# Altium schematic sheet Digital Interfaces.SchDoc
size A4
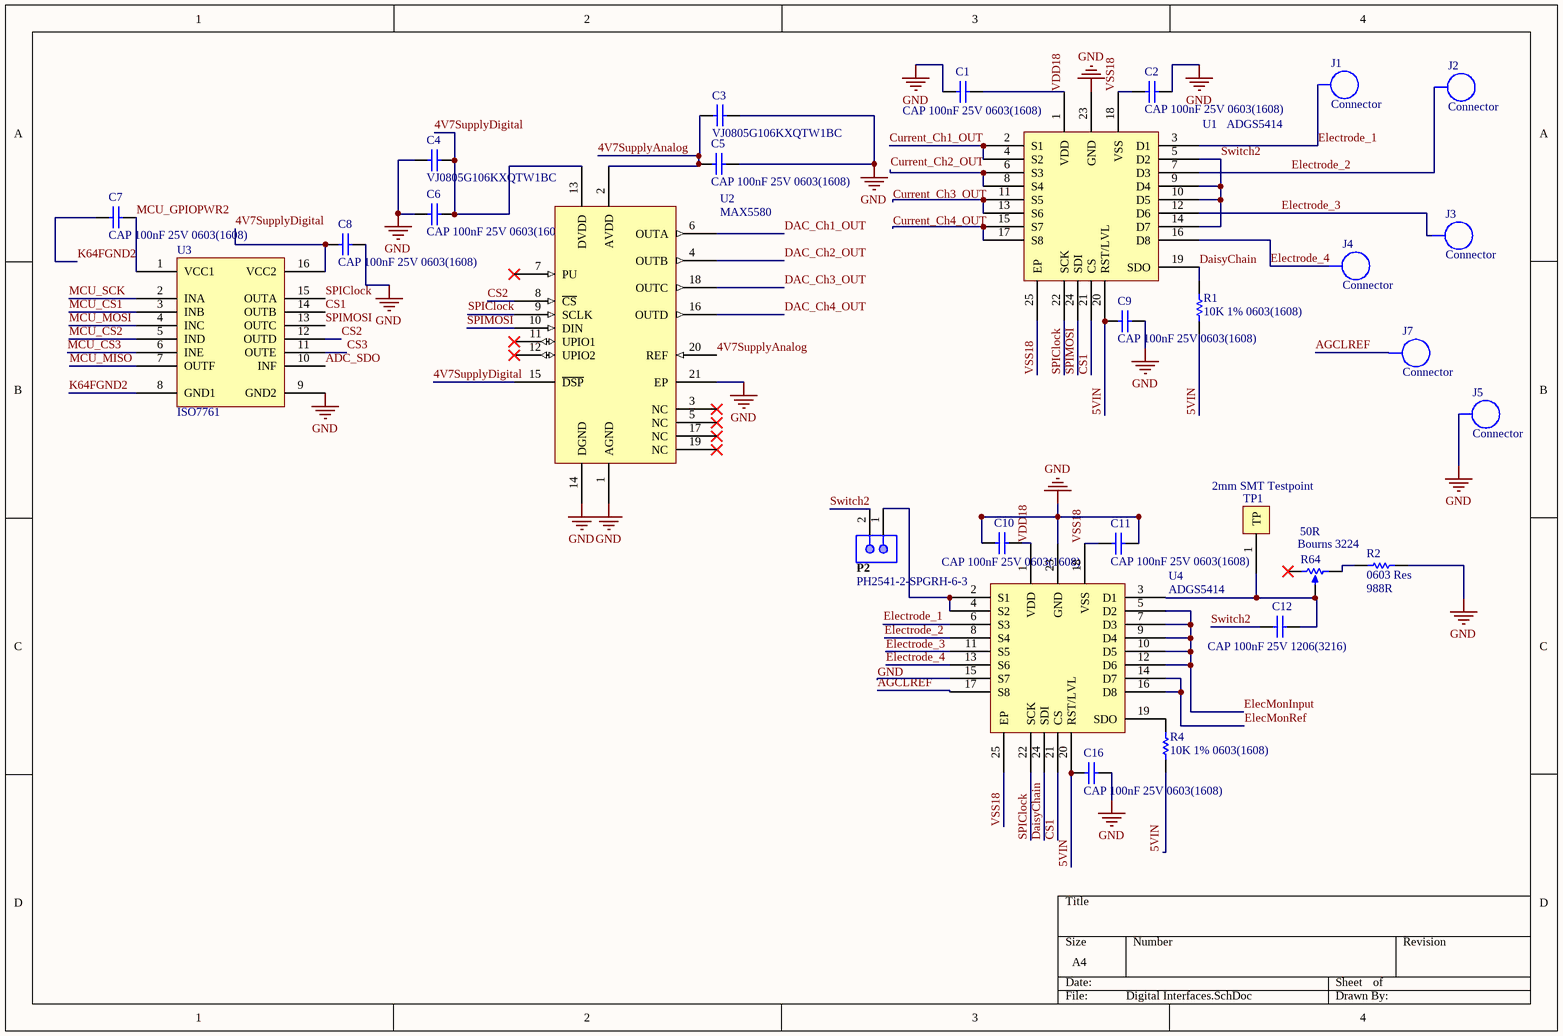
[diagram p0: Digital Interfaces.SchDoc]

## Parts
C1  CAP 100nF 25V 0603(1608)  [CAPC0603(1608)100_N]
C2  CAP 100nF 25V 0603(1608)  [CAPC0603(1608)100_N]
C3  VJ0805G106KXQTW1BC  [CAPC2013X145X50LL20T20]
C4  VJ0805G106KXQTW1BC  [CAPC2013X145X50LL20T20]
C5  CAP 100nF 25V 0603(1608)  [CAPC0603(1608)100_N]
C6  CAP 100nF 25V 0603(1608)  [CAPC0603(1608)100_N]
C7  CAP 100nF 25V 0603(1608)  [CAPC0603(1608)100_N]
C8  CAP 100nF 25V 0603(1608)  [CAPC0603(1608)100_N]
C9  CAP 100nF 25V 0603(1608)  [CAPC0603(1608)100_N]
C10  CAP 100nF 25V 0603(1608)  [CAPC0603(1608)100_N]
C11  CAP 100nF 25V 0603(1608)  [CAPC0603(1608)100_N]
C12  CAP 100nF 25V 1206(3216)  [CAPC1206(3216)190_M]
C16  CAP 100nF 25V 0603(1608)  [CAPC0603(1608)100_N]
J1  Connector  [Molex TermiMate Plug]
J2  Connector  [Molex TermiMate Plug]
J3  Connector  [Molex TermiMate Plug]
J4  Connector  [Molex TermiMate Plug]
J5  Connector  [Molex TermiMate Plug]
J7  Connector  [Molex TermiMate Plug]
P2  PH2541-2-SPGRH-6-3  [PH2541-2-SPGRH-6-3_V]
R1  10K 1% 0603(1608)  [RESC0603(1608)_N]
R2  0603 Res  value 988R  [J1-0603]
R4  10K 1% 0603(1608)  [RESC0603(1608)_N]
R64  Bourns 3224  value 50R  [BOURNS 3224W]
TP1  2mm SMT Testpoint  [Testpoint Harwin S1751]
U1  ADGS5414  [24LFCSP JEDEC MO-220-VGGD-8]
U2  MAX5580  [20TSSOP-EP U20E-1]
U3  ISO7761  [16SSOP JEDEC MO-137 AB]
U4  ADGS5414  [24LFCSP JEDEC MO-220-VGGD-8]

## Nets
GND: C1.1 C2.1 C3.2 C4.1 C5.1 C6.2 C8.1 C9.1 C10.1 C11.1 C16.1 J5.1 R2.1 U1.23(GND) U2.1(AGND) U2.14(DGND) U2.21(EP) U3.9(GND2) U4.15(S7) U4.23(GND)
4V7SupplyAnalog: C3.1 C5.2 U2.2(AVDD) U2.20(REF)
4V7SupplyDigital: C4.2 C6.1 C8.2 U2.13(DVDD) U2.15(~{DSP}) U3.16(VCC2)
5VIN: C9.2 C16.2 R1.1 R4.1 U1.20(RST/LVL) U4.20(RST/LVL)
ADC_SDO: U3.10(INF)
AGCLREF: J7.1 U4.17(S8)
CS1: U1.21(CS) U3.14(OUTB) U4.21(CS)
CS2: U2.8(~{CS}) U3.12(OUTD)
CS3: U3.11(OUTE)
Current_Ch1_OUT: U1.2(S1) U1.4(S2)
Current_Ch2_OUT: U1.6(S3) U1.8(S4)
Current_Ch3_OUT: U1.11(S5) U1.13(S6)
Current_Ch4_OUT: U1.15(S7) U1.17(S8)
DAC_Ch1_OUT: U2.6(OUTA)
DAC_Ch2_OUT: U2.4(OUTB)
DAC_Ch3_OUT: U2.18(OUTC)
DAC_Ch4_OUT: U2.16(OUTD)
DaisyChain: R1.2 U1.19(SDO) U4.24(SDI)
ElecMonInput: U4.5(D2) U4.7(D3) U4.9(D4) U4.10(D5) U4.12(D6)
ElecMonRef: U4.14(D7) U4.16(D8)
Electrode_1: J1.1 U1.3(D1) U4.6(S3)
Electrode_2: J2.1 U1.7(D3) U4.8(S4)
Electrode_3: J3.1 U1.12(D6) U4.11(S5)
Electrode_4: J4.1 U1.16(D8) U4.13(S6)
K64FGND2: C7.2 U3.8(GND1)
MCU_CS1: U3.3(INB)
MCU_CS2: U3.5(IND)
MCU_CS3: U3.6(INE)
MCU_GPIOPWR2: C7.1 U3.1(VCC1)
MCU_MISO: U3.7(OUTF)
MCU_MOSI: U3.4(INC)
MCU_SCK: U3.2(INA)
SPIClock: U1.22(SCK) U2.9(SCLK) U3.15(OUTA) U4.22(SCK)
SPIMOSI: U1.24(SDI) U2.10(DIN) U3.13(OUTC)
Switch2: C12.1 P2.2 U1.5(D2) U1.9(D4) U1.10(D5) U1.14(D7)
VDD18: C1.2 C10.2 U1.1(VDD) U4.1(VDD)
VSS18: C2.2 C11.2 U1.18(VSS) U1.25(EP) U4.18(VSS) U4.25(EP)
NetC12_2: C12.2 R64.2(TAP) TP1.1(TP) U4.3(D1)
NetP2_1: P2.1 U4.2(S1) U4.4(S2)
NetR2_2: R2.2 R64.3(BOT)
NetR4_2: R4.2 U4.19(SDO)

Not connected (* = marked no-connect by the designer): R64 1(TOP)*; U2 3(NC)* 5(NC)* 7(PU)* 11(UPIO1)* 12(UPIO2)* 17(NC)* 19(NC)*

## Library data of the parts
C1 C2 C5-C11 C16 = CMP-1035-02589-1: CAP 100nF 25V ±20% 0603 (1608 Metric) Thickness 1mm SMD; Case-EIA: 0603; Tolerance: Â±20%; Case-Metric: 1608; Value: 100nF; Max Thickness: 1 mm; Technology: SMT; Rated Voltage: 25 V
C3 C4 = CMP-2000-07390-1: Chip Capacitor, 10 uF, +/- 10%, 10 V, -55 to 85 degC, 0805 (2012 Metric), RoHS, Tape and Reel; Manufacturer: Vishay; Capacitance: 10uF; Unit Weight: 0.000194oz; Voltage Rating DC: 10VDC; Brand: Vishay/Vitramon; Dielectric: X5R; Series: VJW1BC; Mounting Technology: SurfaceMount; Case Code - in: 0805; Package Description: 2-Pin Surface Mount Device, Body 2.00 x 1.25 mm; Case Code - mm: 2012; Length: 2mm; Datasheet Version: 07/2016; Manufacturer URL: http://www.vishay.com/; Product Category: MultilayerCeramicCapacitorsMLCC-SMD/SMT; Maximum Operating Temperature: +85C; Datasheet URL: http://www.vishay.com/docs/28548/vjw1bcbascomseries.pdf; Factory Pack Quantity: 3000; Termination Style: SMD/SMT; Package / Case: 0805(2012metric); Minimum Operating Temperature: -55C; Package Reference: 0805; RoHS: True; Width: 1.25mm; Height: 1.25mm; Tolerance: 10%; Packaging: Reel
C12 = CMP-1037-04189-1: CAP 100nF 25V ±5% 1206 (3216 Metric) Thickness 1.9mm SMD; Case-Metric: 3216; Case-EIA: 1206; Tolerance: Â±5%; Rated Voltage: 25 V; Technology: SMT; Max Thickness: 1.9 mm; Value: 100nF
J1-J5 J7 = Molex TermiMate: Molex TermiMate Plug/Receptacle, 1-way SMD Board to Board or Wire to Board Connector
P2 = CMP-0261-00001-1: Male Header, Pitch 2.54mm, 2x1 Position, Mated Height 6mm, Tail Length 3mm; PackageDescription: 2-Pin Male Header IDC, 2.54 x 5.08 mm Body, 2.54 mm Pitch; PartNumber: PH2541-2-SPGRH-6-3; ComponentLink1URL: http://www.suzhoupinchao.com/; Mounting Technology: Through Hole; ComponentLink1Description: Manufacturer URL; PackageReference: PH2541-2-SPGRH-6-3
R1 R4 = CMP-1012-00623-1: 10K 0.1W 1% 0603 (1608 Metric)  SMD; Value: 10000.00 Ohm; Case-EIA: 0603; Case-Metric: 1608; Power: 0.1 W; Tolerance: 1 %; Technology: SMT
R2 = Res1: Chip Resistor, 0603, 1%; Published: 8-Jun-2000; LatestRevisionDate: 17-Jul-2002; LatestRevisionNote: Re-released for DXP Platform.; PackageReference: AXIAL-0.3; Publisher: Altium Limited; PackageDescription: Axial Device, Thru-Hole; 2 Leads; 0.3 in Pin Spacing
R64 = 3224-Series Trimmer Potentiometer: Trimmer Potentiometer, Cermet, 3224-Series (Bourns); Sim Note: Enter the Resistance value and the set point into parameter fields.; Set Position: 0.5; Published: 8-Jun-2000; LatestRevisionDate: 17-Jul-2002; LatestRevisionNote: Re-released for DXP Platform.; PackageReference: VR5; Publisher: Altium Limited; PackageDescription: Variable Resistor, Thru-Hole; 3 Leads
TP1 = TestPoint SMT Harwin S1751: SMT Testpoint, 2mm height, Harwin S1751
U1 U4 = ADGS5414: Octal ±20V SPST Switches, SPI interface, 13.5 ohm Ron, Break before Make
U2 = MAX5580: 12-Bit Voltage DAC, 5.25V Single Supply, Buffered Fast-Settling, SPI input, Daisy Chainable
U3 = ISO7761: Capacitive Digital Isolator, 5 forward channels 1 reverse channel, failsafe high, 100 Mbps, 2.25-5.5V